# Altium schematic sheet Main.SchDoc
size A; SheetNumber: 1; SheetTotal: 8
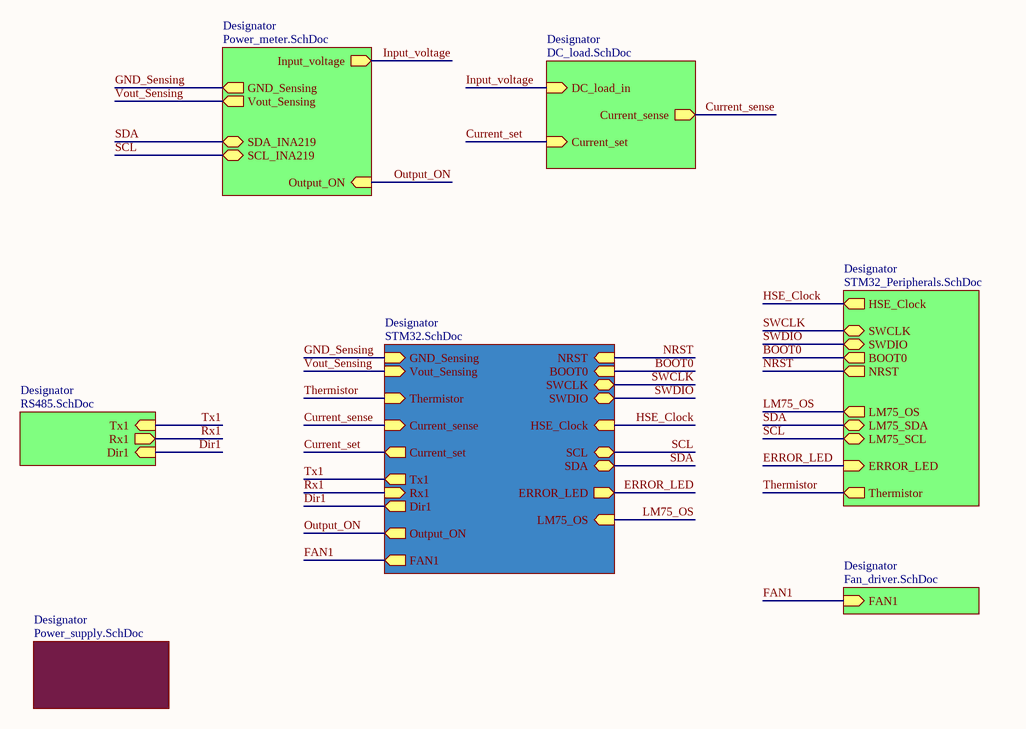
[diagram p0: Main.SchDoc]

## Sub-sheets
Designator = DC_load.SchDoc: Current_set (in), DC_load_in (in), Current_sense (out)
Designator = Power_meter.SchDoc: SCL_INA219 (bidir), SDA_INA219 (bidir), Output_ON (in), GND_Sensing (out), Vout_Sensing (out), Input_voltage (out)
Designator = RS485.SchDoc: Tx1 (in), Rx1 (out), Dir1 (in)
Designator = Fan_driver.SchDoc: FAN1 (in)
Designator = Power_supply.SchDoc: no entries
Designator = STM32.SchDoc: NRST (in), BOOT0 (in), SWCLK (bidir), SWDIO (bidir), SCL (bidir), SDA (bidir), GND_Sensing (in), Vout_Sensing (in), FAN1 (out), LM75_OS (in), HSE_Clock (in), ERROR_LED (out), Tx1 (out), Rx1 (in), Dir1 (out), Output_ON (out), Current_set (out), Thermistor (in), Current_sense (in)
Designator = STM32_Peripherals.SchDoc: HSE_Clock (out), SWCLK (bidir), SWDIO (bidir), BOOT0 (out), NRST (out), LM75_OS (out), LM75_SDA (bidir), LM75_SCL (bidir), ERROR_LED (in), Thermistor (out)

## Nets
BOOT0: sheet Designator/BOOT0, sheet Designator/BOOT0
Current_sense: sheet Designator/Current_sense, sheet Designator/Current_sense
Current_set: sheet Designator/Current_set, sheet Designator/Current_set
Dir1: sheet Designator/Dir1, sheet Designator/Dir1
ERROR_LED: sheet Designator/ERROR_LED, sheet Designator/ERROR_LED
FAN1: sheet Designator/FAN1, sheet Designator/FAN1
GND_Sensing: sheet Designator/GND_Sensing, sheet Designator/GND_Sensing
HSE_Clock: sheet Designator/HSE_Clock, sheet Designator/HSE_Clock
Input_voltage: sheet Designator/DC_load_in, sheet Designator/Input_voltage
LM75_OS: sheet Designator/LM75_OS, sheet Designator/LM75_OS
NRST: sheet Designator/NRST, sheet Designator/NRST
Output_ON: sheet Designator/Output_ON, sheet Designator/Output_ON
Rx1: sheet Designator/Rx1, sheet Designator/Rx1
SCL: sheet Designator/SCL_INA219, sheet Designator/SCL, sheet Designator/LM75_SCL
SDA: sheet Designator/SDA_INA219, sheet Designator/SDA, sheet Designator/LM75_SDA
SWCLK: sheet Designator/SWCLK, sheet Designator/SWCLK
SWDIO: sheet Designator/SWDIO, sheet Designator/SWDIO
Thermistor: sheet Designator/Thermistor, sheet Designator/Thermistor
Tx1: sheet Designator/Tx1, sheet Designator/Tx1
Vout_Sensing: sheet Designator/Vout_Sensing, sheet Designator/Vout_Sensing